# EAGLE schematic 15A-005 (EAGLE 9.6.2)
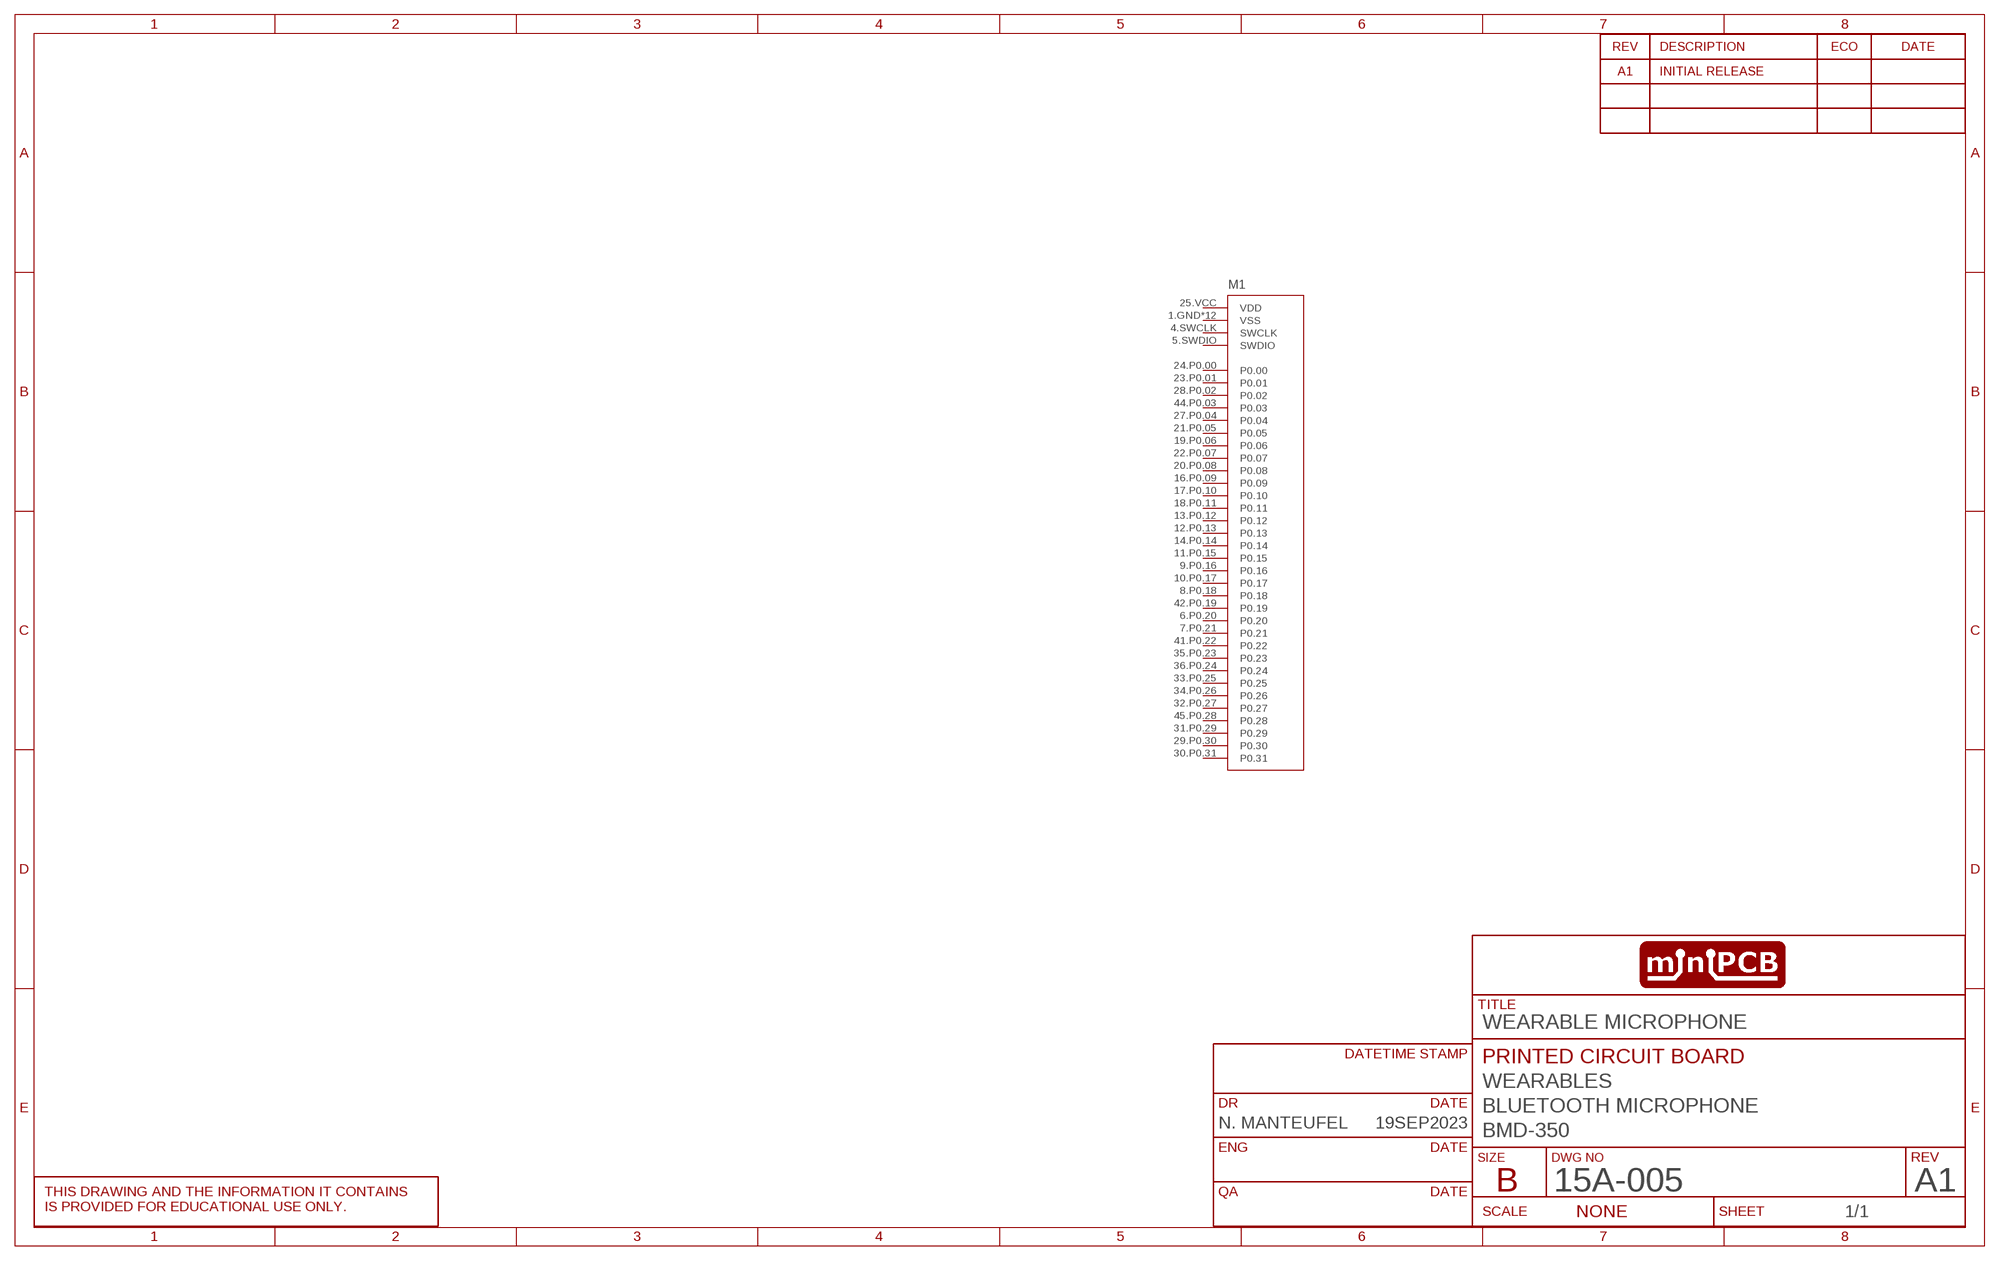
[diagram p0: schematic, sheet 1]
SHEET1 (SCHEMATIC): CIRCUIT_CATEGORY: WEARABLES; CIRCUIT_NAME: BLUETOOTH MICROPHONE; CIRCUIT_VARIANT: BMD-350; DR: N. MANTEUFEL; DR_DATE: 19SEP2023; PCB_PCBA: PRINTED CIRCUIT BOARD; REVA: A1; REVISION: A1; TITLE: WEARABLE MICROPHONE

## Parts
M1  BMD-350  [BDM350]
Unconnected: M1.1.GND(VSS) M1.2.GND(VSS) M1.3.GND(VSS) M1.4.SWCLK(SWCLK) M1.5.SWDIO(SWDIO) M1.6.P0.20(P0.20) M1.7.P0.21(P0.21) M1.8.P0.18(P0.18) M1.9.P0.16(P0.16) M1.10.P0.17(P0.17) M1.11.P0.15(P0.15) M1.12.P0.13(P0.13) M1.13.P0.12(P0.12) M1.14.P0.14(P0.14) M1.15.GND(VSS) M1.16.P0.09(P0.09) M1.17.P0.10(P0.10) M1.18.P0.11(P0.11) M1.19.P0.06(P0.06) M1.20.P0.08(P0.08) M1.21.P0.05(P0.05) M1.22.P0.07(P0.07) M1.23.P0.01(P0.01) M1.24.P0.00(P0.00) M1.25.VCC(VDD) M1.26.GND(VSS) M1.27.P0.04(P0.04) M1.28.P0.02(P0.02) M1.29.P0.30(P0.30) M1.30.P0.31(P0.31) M1.31.P0.29(P0.29) M1.32.P0.27(P0.27) M1.33.P0.25(P0.25) M1.34.P0.26(P0.26) M1.35.P0.23(P0.23) M1.36.P0.24(P0.24) M1.37.GND(VSS) M1.38.GND(VSS) M1.39.GND(VSS) M1.40.GND(VSS) M1.41.P0.22(P0.22) M1.42.P0.19(P0.19) M1.43.GND(VSS) M1.44.P0.03(P0.03) M1.45.P0.28(P0.28) M1.46.GND(VSS) M1.47.GND(VSS)

## Library data of the parts
M1 = SIG_ICS:BMD-350